# EAGLE design Jalosie4-DC24V current sensing -v01 (EAGLE 9.3.0)

## Sheet 1 of 2: Jalosieaktor DC24V 4-fach
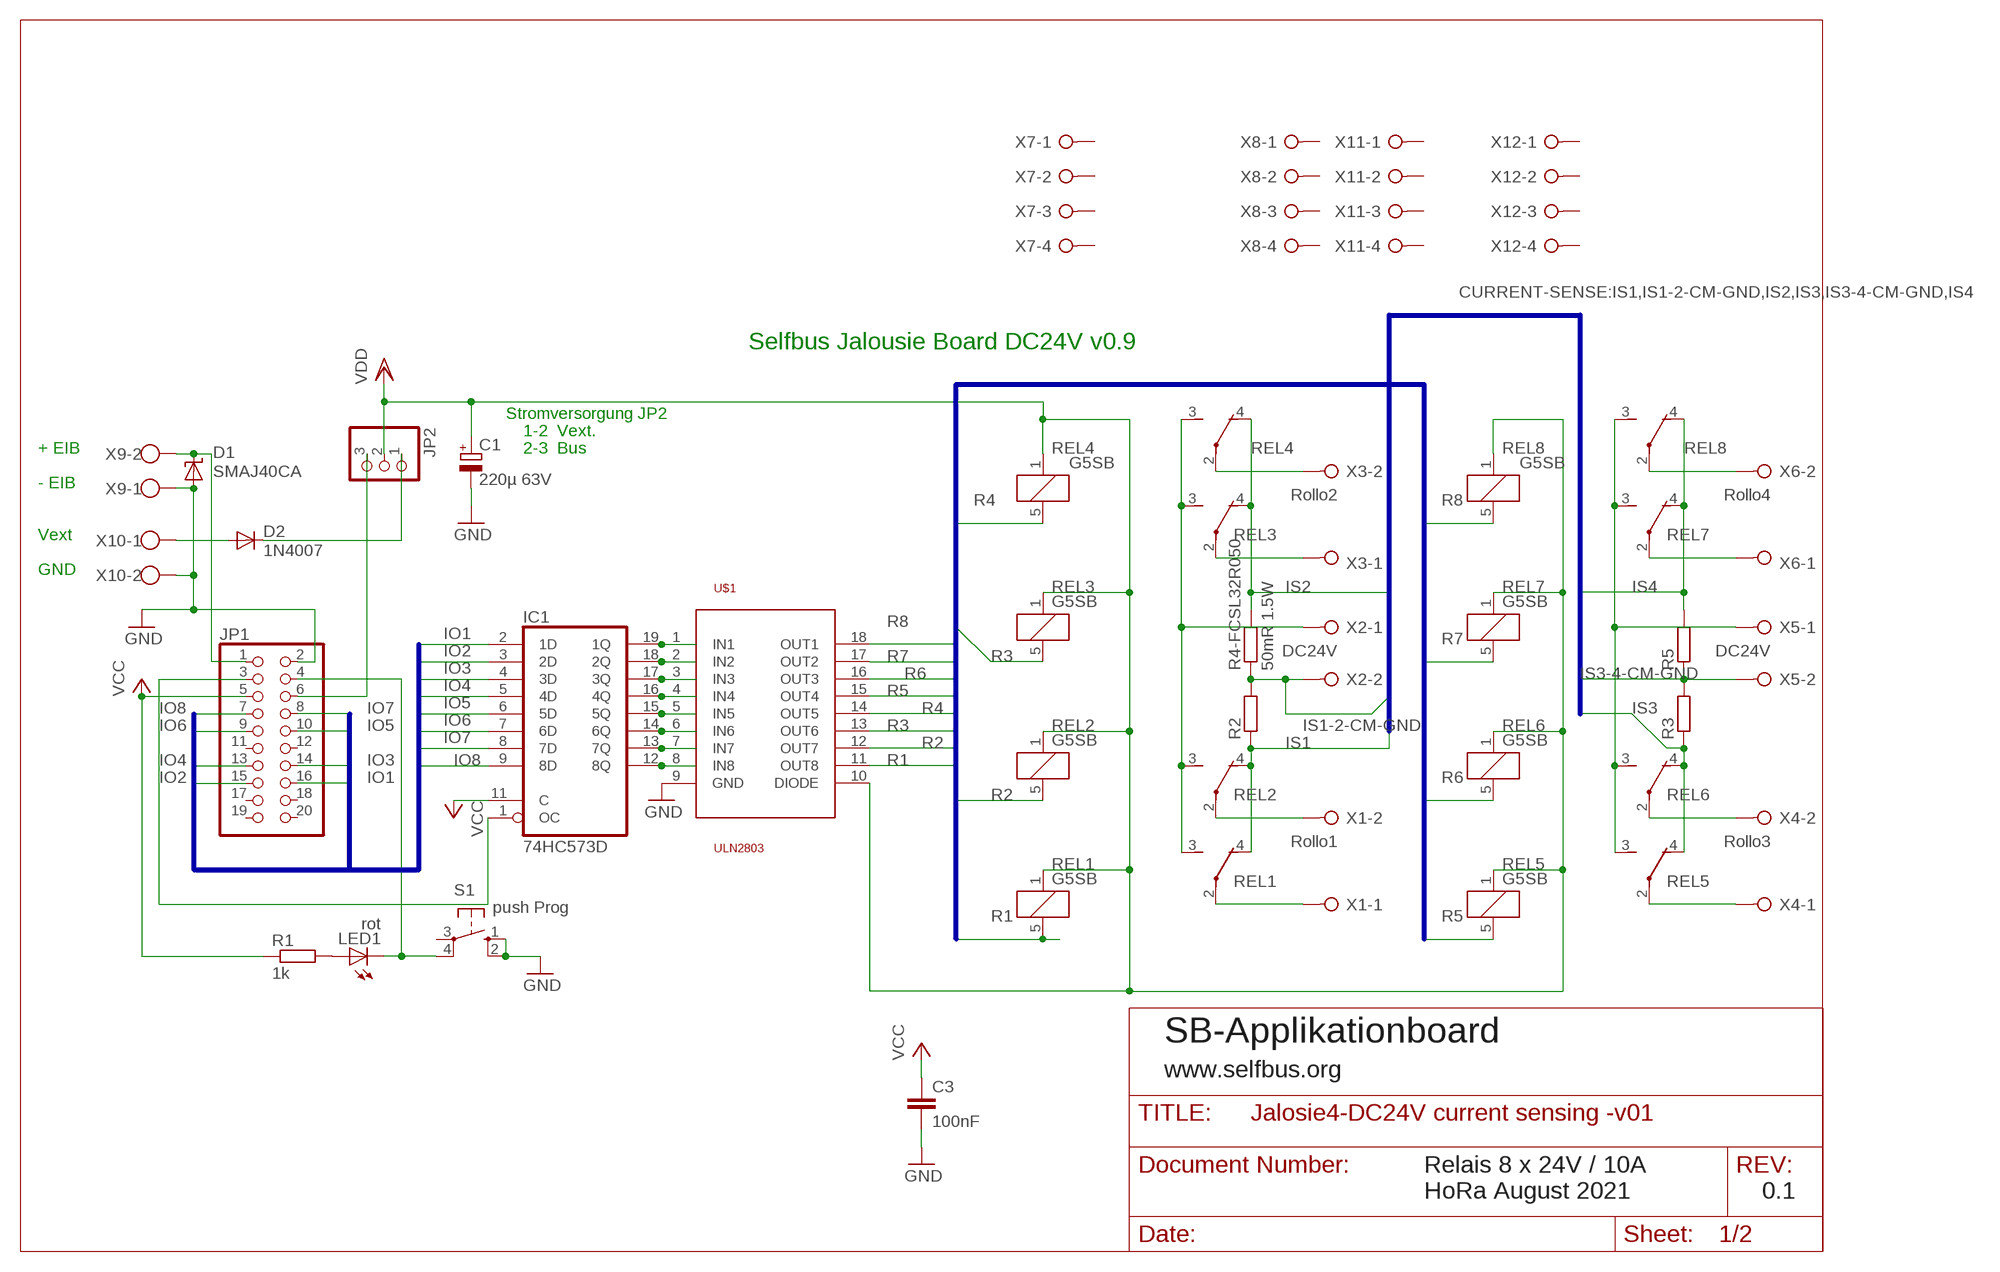
[diagram p0: schematic, sheet 1]

### Parts
C1  220µ 63V  CPOL-EUTT5D10  [TT5D10]
C3  100nF  C-EU050-024X044  [C050-024X044]
D1  SMAJ40CA  SUPPRESSOR-SMBJ  [SMBJ]
D2  1N4007  1N4004  [DO41-10]
IC1  74HC573D  [SO20W]
JP1  PINHD-2X10  [2X10]
JP2  PINHD-1X3  [1X03]
LED1  rot  LED3MM  [LED3MM]
R1  1k  R-EU_0204/7  [0204/7]
R2  R-EU_R3225  [R3225]
R3  R-EU_R3225  [R3225]
R4-FCSL32R050  50mR 1.5W  R-EU_R3225  [R3225]
R5  R-EU_R3225  [R3225]
REL1  G5SB  [G5SB]
REL2  G5SB  [G5SB]
REL3  G5SB  [G5SB]
REL4  G5SB  [G5SB]
REL5  G5SB  [G5SB]
REL6  G5SB  [G5SB]
REL7  G5SB  [G5SB]
REL8  G5SB  [G5SB]
S1  push Prog  10-XX  [B3F-10XX]
U$1  ULN2803  [SO18L]
X1  Rollo1  W237-02P  [W237-132]
X2  DC24V  W237-02P  [W237-132]
X3  Rollo2  W237-02P  [W237-132]
X4  Rollo3  W237-02P  [W237-132]
X5  DC24V  W237-02P  [W237-132]
X6  Rollo4  W237-02P  [W237-132]
X7  W237-04P  [W237-4P]
X8  W237-04P  [W237-4P]
X9  W237-102  [W237-102]
X10  W237-102  [W237-102]
X11  W237-04P  [W237-4P]
X12  W237-04P  [W237-4P]

### Nets
GND: C1.- C3.2 D1.A JP1.2 S1.1(S) S1.2(S1) U$1.9(GND) X9.1 X10.2 ; also sheet 2
IO1: IC1.2(1D) JP1.16
IO2: IC1.3(2D) JP1.15
IO3: IC1.4(3D) JP1.14
IO4: IC1.5(4D) JP1.13
IO5: IC1.6(5D) JP1.10
IO6: IC1.7(6D) JP1.9
IO7: IC1.8(7D) JP1.8
IO8: IC1.9(8D) JP1.7
IS1 [dc24v]: R2.1 REL1.4(U:O) REL2.4(U:O)
IS1-2-CM-GND [dc24v]: R2.2 R4-FCSL32R050.1 X2.2
IS2 [dc24v]: R4-FCSL32R050.2 REL3.4(U:O) REL4.4(U:O)
IS3 [dc24v]: R3.1 REL5.4(U:O) REL6.4(U:O)
IS3-4-CM-GND [dc24v]: R3.2 R5.1 X5.2
IS4 [dc24v]: R5.2 REL7.4(U:O) REL8.4(U:O)
N$2 [dc24v]: REL4.2(U:P) X3.2
N$3 [dc24v]: REL2.2(U:P) X1.2
N$4 [dc24v]: REL1.2(U:P) X1.1
N$5: REL3.2(U:P) X3.1
N$8 [dc24v]: REL5.3(U:S) REL6.3(U:S) REL7.3(U:S) REL8.3(U:S) X5.1
N$9 [dc24v]: REL7.2(U:P) X6.1
N$10 [dc24v]: REL8.2(U:P) X6.2
N$11: JP1.4 LED1.K(C) S1.4(P1)
N$12: LED1.A R1.2
N$13 [dc24v]: REL1.3(U:S) REL2.3(U:S) REL3.3(U:S) REL4.3(U:S) X2.1
N$14 [dc24v]: REL6.2(U:P) X4.2
N$15 [dc24v]: REL5.2(U:P) X4.1
N$17: D2.A X10.1
N$18: JP1.6 JP2.3
N$20: D1.C JP1.1 X9.2
N$21: IC1.19(1Q) U$1.1(IN1)
N$22: IC1.18(2Q) U$1.2(IN2)
N$23: IC1.17(3Q) U$1.3(IN3)
N$24: IC1.16(4Q) U$1.4(IN4)
N$25: IC1.15(5Q) U$1.5(IN5)
N$27: IC1.14(6Q) U$1.6(IN6)
N$28: IC1.13(7Q) U$1.7(IN7)
N$29: IC1.12(8Q) U$1.8(IN8)
N$31: D2.C JP2.1
N$33: IC1.1(OC) JP1.3
R1: REL1.5 U$1.11(OUT8)
R2: REL2.5 U$1.12(OUT7)
R3: REL3.5 U$1.13(OUT6)
R4: REL4.5 U$1.14(OUT5)
R5: REL5.5 U$1.15(OUT4)
R6: REL6.5 U$1.16(OUT3)
R7: REL7.5 U$1.17(OUT2)
R8: REL8.5 U$1.18(OUT1)
VCC: C3.1 IC1.11(C) JP1.5 R1.1 ; also sheet 2
VDD: C1.+ JP2.2 REL1.1 REL2.1 REL3.1 REL4.1 REL5.1 REL6.1 REL7.1 REL8.1 U$1.10(DIODE)
Unconnected: JP1.11 JP1.12 JP1.17 JP1.18 JP1.19 JP1.20 S1.3(P) X7.1 X7.2 X7.3 X7.4 X8.1 X8.2 X8.3 X8.4 X11.1 X11.2 X11.3 X11.4 X12.1 X12.2 X12.3 X12.4

### Buses
R[1..8]
IO[1..8]
CURRENT-SENSE:IS1,IS1-2-CM-GND,IS2,IS3,IS3-4-CM-GND,IS4

### Notes on the sheet
- Selfbus Jalousie Board DC24V v0.9
- Stromversorgung JP2
- 1-2  Vext.
- + EIB | 2-3  Bus
- - EIB
- Vext
- GND
- SB-Applikationboard
- www.selfbus.org
- Relais 8 x 24V / 10A
  HoRa August 2021
- 0.1

## Sheet 2 of 2
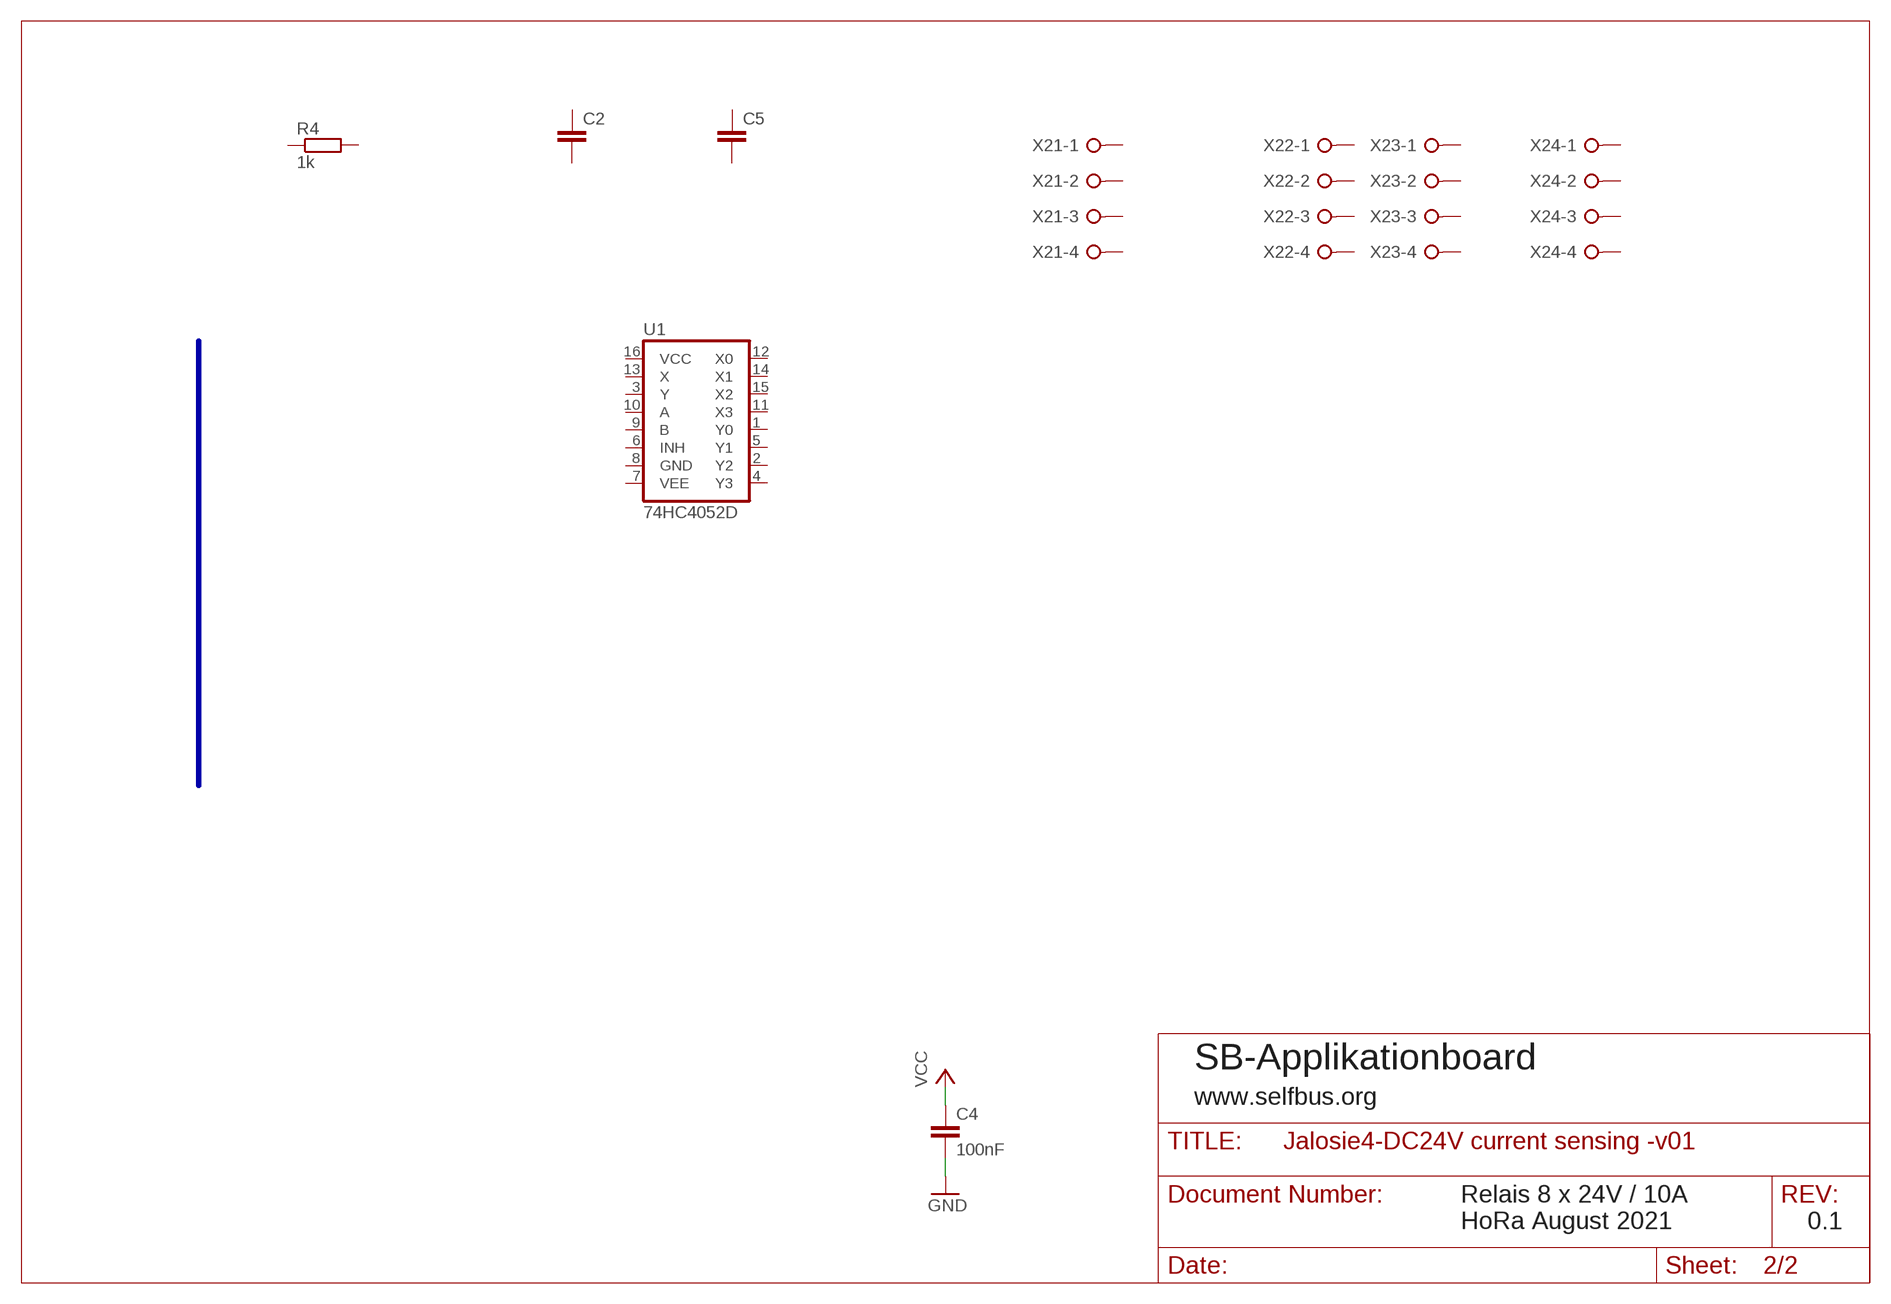
[diagram p1: schematic, sheet 2]

### Parts
C2  C-EUC0603  [C0603]
C4  100nF  C-EU050-024X044  [C050-024X044]
C5  C-EUC0603  [C0603]
R4  1k  R-EU_0204/7  [0204/7]
U1  74HC4052D  [SO16]
X21  W237-04P  [W237-4P]
X22  W237-04P  [W237-4P]
X23  W237-04P  [W237-4P]
X24  W237-04P  [W237-4P]

### Nets
GND: C4.2 ; also sheet 1
VCC: C4.1 ; also sheet 1
Unconnected: C2.1 C2.2 C5.1 C5.2 R4.1 R4.2 U1.1(Y0) U1.2(Y2) U1.3(Y) U1.4(Y3) U1.5(Y1) U1.6(INH) U1.9(B) U1.10(A) U1.11(X3) U1.12(X0) U1.13(X) U1.14(X1) U1.15(X2) X21.1 X21.2 X21.3 X21.4 X22.1 X22.2 X22.3 X22.4 X23.1 X23.2 X23.3 X23.4 X24.1 X24.2 X24.3 X24.4

### Buses
CURRENT-SENSE:IS1,IS1-2-CM-GND,IS2,IS3,IS3-4-CM-GND,IS4

### Notes on the sheet
- SB-Applikationboard
- www.selfbus.org
- Relais 8 x 24V / 10A
  HoRa August 2021
- 0.1

## Power pins joined to a net without a drawn wire
GND: IC1.10(GND) U1.8(GND)
VCC: IC1.20(VCC) U1.16(VCC)
VEE: U1.7(VEE)

## Library data of the parts
C1 = rcl:CPOL-EU: POLARIZED CAPACITOR, European symbol
C2 C5 = rcl:C-EU: CAPACITOR, European symbol; SPICEPREFIX: C
C3 C4 = rcl:C-EU: CAPACITOR, European symbol
D1 = diode:SUPPRESSOR-: Suppressor diode
D2 = diode:1N4004: DIODE general purpose rectifier, 1 A
IC1 = 74xx-eu:74*573: 8-bit D latch BUS DRIVER
JP1 = pinhead:PINHD-2X10: PIN HEADER
JP2 = pinhead:PINHD-1X3: PIN HEADER
LED1 = led:LED: LED OSRAM: - CHIPLED LG R971, LG N971, LY N971, LG Q971, LY Q971, LO R971, LY R971 LH N974, LH R974 LS Q976, LO Q976, LY Q976 LO Q996 - Hyper CHIPLED LW Q18S LB Q993, LB Q99A, LB R99A - SideLED LS A670, LO A670, LY A670, LG A670, LP A670 LB A673, LV A673, LT A673, LW A673 LH A674 LY A675 LS A676, LA A676, LO A676, LY A676, LW A676 LS A679, LY A679, LG A679 - Hyper Micro SIDELED® LS Y876, LA Y876, LO Y876, LY Y876 LT Y87S - SmartLED LW L88C, LW L88S LB L89C, LB L89S, LG L890 LS L89K, LO L89K, LY L89K LS L896, LA L896, LO L896, LY L896 - TOPLED LS T670, LO T670, LY T670, LG T670, LP T670 LSG T670, LSP T670, LSY T670, LOP T670, LYG T670 LG T671, LOG T671, LSG T671 LB T673, LV T673, LT T673, LW T673 LH T674 LS T676, LA T676, LO T676, LY T676, LB T676, LH T676, LSB T676, LW T676 LB T67C, LV T67C, LT T67C, LS T67K, LO T67K, LY T67K, LW E67C LS E67B, LA E67B, LO E67B, LY E67B, LB E67C, LV E67C, LT E67C LW T67C LS T679, LY T679, LG T679 LS T770, LO T770, LY T770, LG T770, LP T770 LB T773, LV T773, LT T773, LW T773 LH T774 LS E675, LA E675, LY E675, LS T675 LS T776, LA T776, LO T776, LY T776, LB T776 LHGB T686 LT T68C, LB T68C - Hyper Mini TOPLED® LB M676 - Mini TOPLED Santana® LG M470 LS M47K, LO M47K, LY M47K Source: http://www.osram.convergy.de - LUMILED® LXK2-PW12-R00, LXK2-PW12-S00, LXK2-PW14-U00, LXK2-PW14-V00 LXK2-PM12-R00, LXK2-PM12-S00, LXK2-PM14-U00 LXK2-PE12-Q00, LXK2-PE12-R00, LXK2-PE12-S00, LXK2-PE14-T00, LXK2-PE14-U00 LXK2-PB12-K00, LXK2-PB12-L00, LXK2-PB12-M00, LXK2-PB14-N00, LXK2-PB14-P00, LXK2-PB14-Q00 LXK2-PR12-L00, LXK2-PR12-M00, LXK2-PR14-Q00, LXK2-PR14-R00 LXK2-PD12-Q00, LXK2-PD12-R00, LXK2-PD12-S00 LXK2-PH12-R00, LXK2-PH12-S00 LXK2-PL12-P00, LXK2-PL12-Q00, LXK2-PL12-R00 Source: www.luxeon.com
R1 R4 = rcl:R-EU_: RESISTOR, European symbol
R2 R3 R4-FCSL32R050 R5 = rcl:R-EU_: RESISTOR, European symbol; SPICEPREFIX: R
REL1-REL8 = relay:G5SB: Compact Single-pole Relay for Switching 5 A Source: http://www.omron.com/ecb/products/pry/121/g5sb.html; OC_FARNELL: unknown; OC_NEWARK: unknown
S1 = switch-omron:10-XX: OMRON SWITCH
U1 = SparkFun-IC-Logic:74*4052: Dual 4:1 Analog Mux Dual four-channel analog MULTIPLEXER / DEMULTIPLEXER SparkFun Products SparkFun Vernier Interface Shield <https://www.sparkfun.com/products/12858> (DEV-12858); PROD_ID: IC-13103
U$1 = uln2803:ULN2803
X1-X6 = con-wago-508:W237-02P: WAGO SREW CLAMP; OC_FARNELL: unknown; OC_NEWARK: unknown
X7 X8 X11 X12 X21-X24 = con-wago-508:W237-04P: WAGO SREW CLAMP; OC_FARNELL: unknown; OC_NEWARK: unknown
X9 X10 = con-wago-500:W237-102: WAGO SCREW CLAMP

## Net classes
0 SELV: width 0.406 mm
1 dc24v: width 1.93 mm, clearance 1.27 mm to class 0, clearance 1.27 mm

## Board
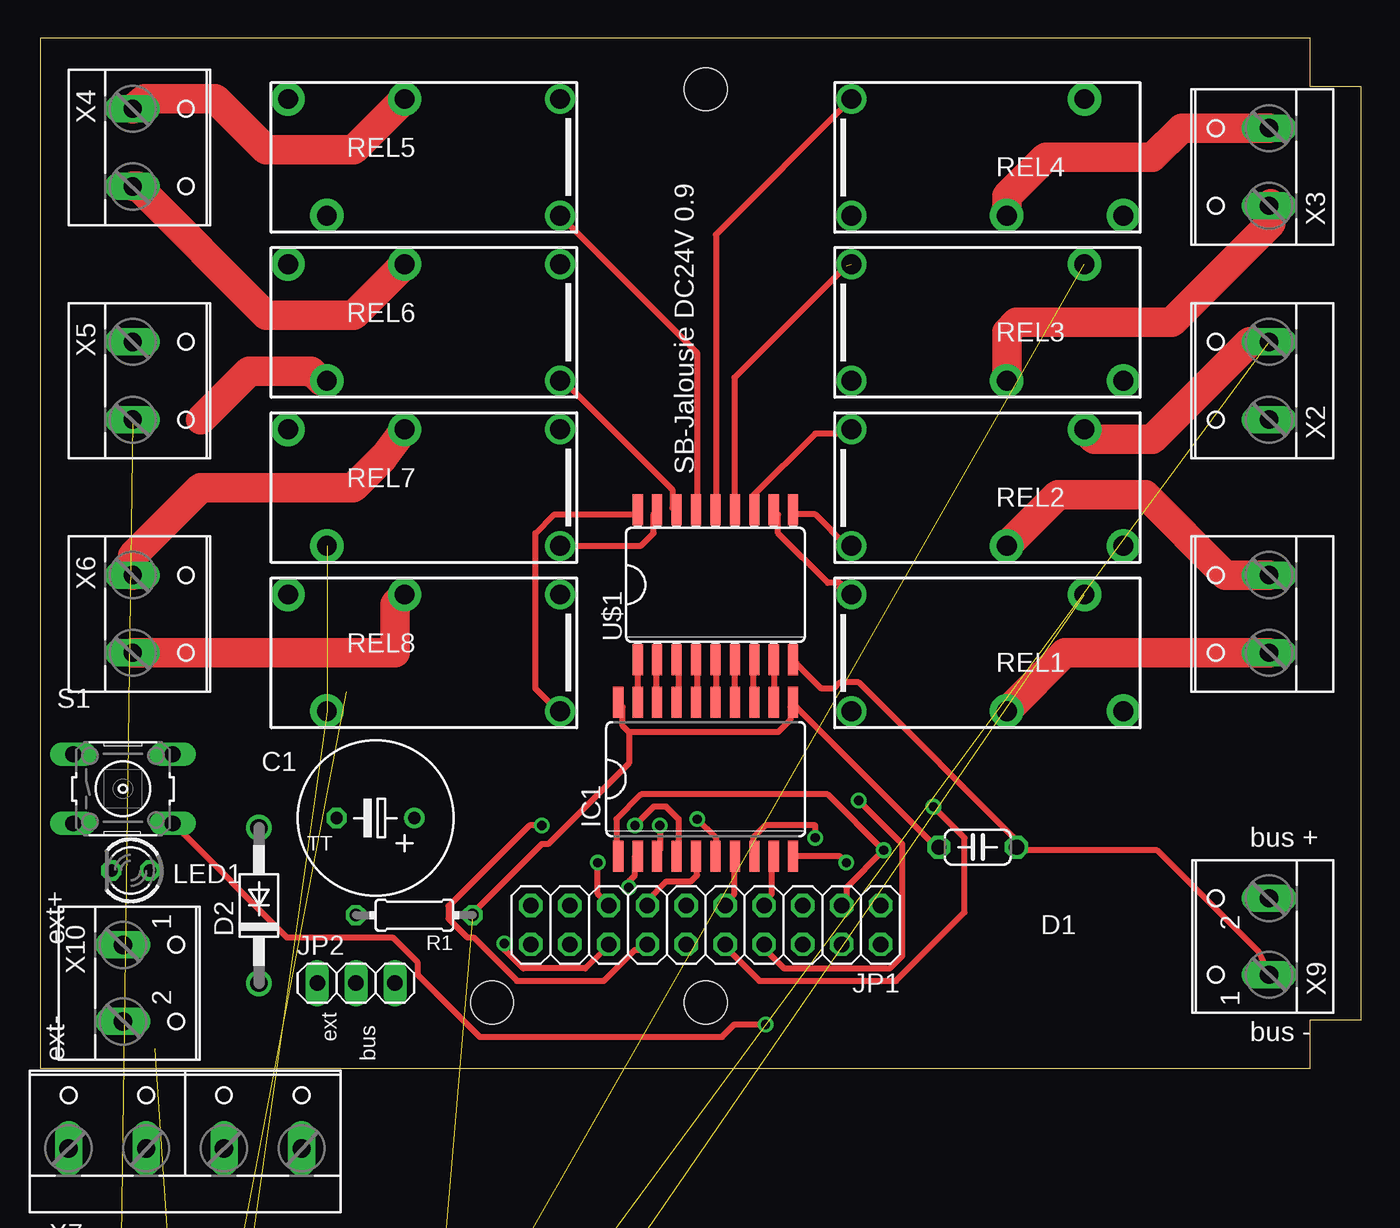
[diagram p2: board, top side]
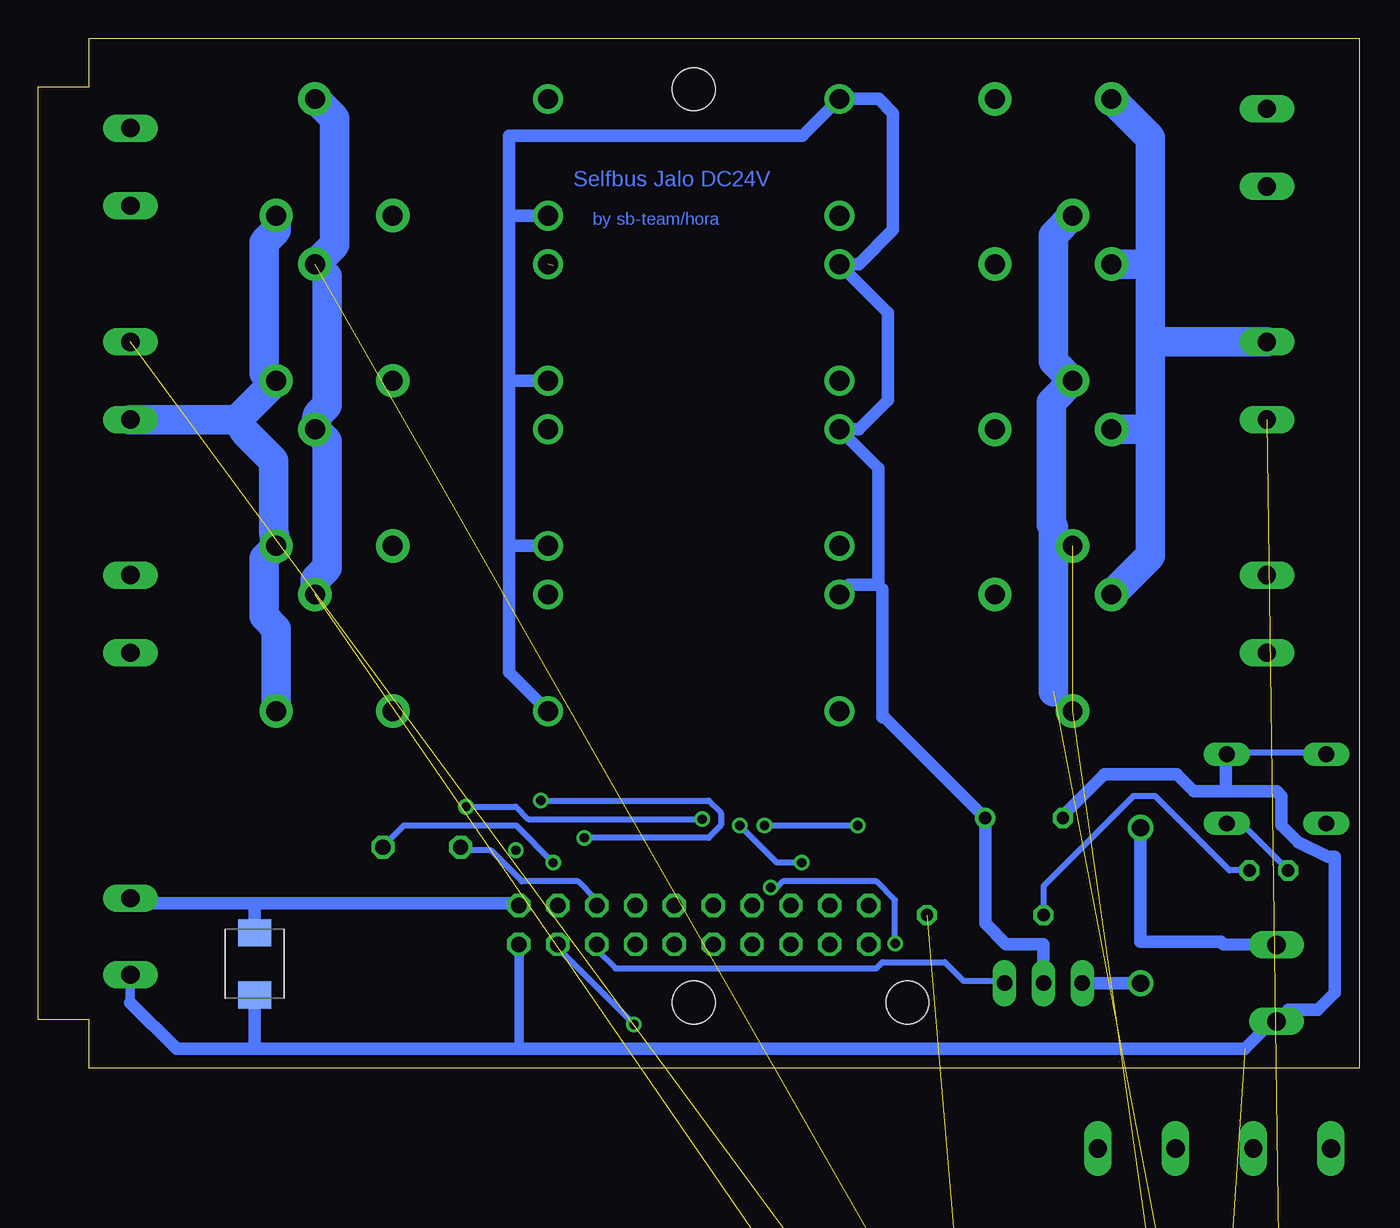
[diagram p3: board, bottom side, seen from below]

Size 86.35 x 67.31 mm. Coordinates in mm from the lower left corner, seen from the top.
Outline: 0,0.01 83.02,0 83.02,3.18 86.35,3.18 86.35,64.13 83.02,64.13 83.02,67.31 0,67.31 0,0.01
Copper layers (1*16): Top 0.035mm / dielectric 1.5mm / Bottom 0.035mm
Design rules "default *": minimum track width 10mil, minimum drill 24mil, track to track 16mil, track to pad 16mil, pad to pad 16mil, via to via 16mil, smd to smd 8mil, copper to edge 20mil, drill to drill 10mil, minimum pad ring 10mil, minimum via ring 8mil, stop-mask expansion 4mil, vias tented up to drill 0mil, thermal gap 10mil
Holes 2.8 mm at 43.49,4.29 43.49,63.98 29.52,4.29

### Footprints (pad centres in the part's own frame; a part is rotated, then mirrored left to right if it is on the bottom)
TT5D10 = drill 0.813: + -2.54,0 | drill 0.813 octagon: - 2.54,0
C0603 = smd 1.1 x 1: 1 -0.85,0; 2 0.85,0
C050-024X044 = drill 1 octagon: 1 -2.54,0; 2 2.54,0
SMBJ = smd 1.78 x 2.16: A 2.04,0; C -2.03,0
DO41-10 = drill 1.118: A 5.08,0; C -5.08,0
SO20W = smd 0.66 x 2.032: 1 -5.715,-5.029; 2 -4.445,-5.029; 3 -3.175,-5.029; 4 -1.905,-5.029; 5 -0.635,-5.029; 6 0.635,-5.029; 7 1.905,-5.029; 8 3.175,-5.029; 9 4.445,-5.029; 10 5.715,-5.029; 11 5.715,5.029; 12 4.445,5.029; 13 3.175,5.029; 14 1.905,5.029; 15 0.635,5.029; 16 -0.635,5.029; 17 -1.905,5.029; 18 -3.175,5.029; 19 -4.445,5.029; 20 -5.715,5.029
2X10 = drill 1.016 octagon: 1 -11.43,-1.27; 2 -11.43,1.27; 3 -8.89,-1.27; 4 -8.89,1.27; 5 -6.35,-1.27; 6 -6.35,1.27; 7 -3.81,-1.27; 8 -3.81,1.27; 9 -1.27,-1.27; 10 -1.27,1.27; 11 1.27,-1.27; 12 1.27,1.27; 13 3.81,-1.27; 14 3.81,1.27; 15 6.35,-1.27; 16 6.35,1.27; 17 8.89,-1.27; 18 8.89,1.27; 19 11.43,-1.27; 20 11.43,1.27
1X03 = drill 1.016 long: 1 -2.54,0; 2 0,0; 3 2.54,0
LED3MM = drill 0.813 octagon: A -1.27,0; K 1.27,0
0204/7 = drill 0.813 octagon: 1 -3.81,0; 2 3.81,0
R3225 = smd 1.6 x 2.7: 1 -1.4,0; 2 1.4,0
G5SB = drill 1.3 pad 1.93: 1 7.62,3.81; 5 7.62,-3.81 | drill 1.3 pad 2.184: 2 -2.54,3.81; 3 -10.16,3.81; 4 -7.62,-3.81
B3F-10XX = drill 1.016 long: 1 -3.251,2.261; 2 3.251,2.261; 3 -3.251,-2.261; 4 3.251,-2.261
SO16 = smd 0.6 x 1.2: 1 -4.445,-2.8; 2 -3.175,-2.8; 3 -1.905,-2.8; 4 -0.635,-2.8; 5 0.635,-2.8; 6 1.905,-2.8; 7 3.175,-2.8; 8 4.445,-2.8; 9 4.445,2.8; 10 3.175,2.8; 11 1.905,2.8; 12 0.635,2.8; 13 -0.635,2.8; 14 -1.905,2.8; 15 -3.175,2.8; 16 -4.445,2.8
SO18L = smd 0.66 x 2.032: 1 -5.08,-4.902; 2 -3.81,-4.902; 3 -2.54,-4.902; 4 -1.27,-4.902; 5 0,-4.902; 6 1.27,-4.902; 7 2.54,-4.902; 8 3.81,-4.902; 9 5.08,-4.902; 10 5.08,4.902; 11 3.81,4.902; 12 2.54,4.902; 13 1.27,4.902; 14 0,4.902; 15 -1.27,4.902; 16 -2.54,4.902; 17 -3.81,4.902; 18 -5.08,4.902
W237-132 = drill 1.194 long: 1 -2.54,-0.635; 2 2.54,-0.635
W237-4P = drill 1.194 long: 1 -7.62,-0.635; 2 -2.54,-0.635; 3 2.54,-0.635; 4 7.62,-0.635
W237-102 = drill 1.194 long: 1 -2.5,-1.27; 2 2.5,-1.27

### Placement (x,y rotation side)
C1  21.9,16.35 180 top
C2  1.04,-173.79 0 top  (outside the outline)
C3  61.27,14.45 0 top
C4  16.04,-163.79 0 top  (outside the outline)
C5  1.04,-177.79 0 top  (outside the outline)
D1  72.19,6.83 270 bottom
D2  14.28,10.64 90 top
IC1  43.49,18.89 0 top
JP1  43.49,9.37 180 top
JP2  20.63,5.56 0 top
LED1  5.9,12.92 180 top
R1  24.44,10 180 top
R2  3.04,-65.79 0 top  (outside the outline)
R3  3.04,-71.79 0 top  (outside the outline)
R4  4.04,-169.79 0 top  (outside the outline)
R4-FCSL32R050  2.34,-60.23 0 top  (outside the outline)
R5  3.04,-77.79 0 top  (outside the outline)
REL1  60.64,27.15 180 top
REL2  60.64,37.94 180 top
REL3  60.64,48.74 180 top
REL4  60.64,59.53 180 top
REL5  26.35,59.53 0 top
REL6  26.35,48.74 0 top
REL7  26.35,37.94 0 top
REL8  26.35,27.15 0 top
S1  5.39,18.26 0 top
U1  6.04,-182.79 0 top  (outside the outline)
U$1  44.13,31.59 0 top
X1  79.69,29.69 90 top
X2  79.69,44.93 90 top
X3  79.69,58.9 90 top
X4  6.66,60.17 270 top
X5  6.66,44.93 270 top
X6  6.66,29.69 270 top
X7  9.46,-4.6 0 top  (outside the outline)
X8  9.46,-16.54 0 top  (outside the outline)
X9  79.05,8.6 90 top
X10  6.66,5.56 270 top
X11  9.46,-28.48 0 top  (outside the outline)
X12  9.46,-40.42 0 top  (outside the outline)
X21  43.04,-97.79 0 top  (outside the outline)
X22  10.04,-110.79 0 top  (outside the outline)
X23  31.04,-110.79 0 top  (outside the outline)
X24  52.04,-110.79 0 top  (outside the outline)

### Tracks (layer width: path | path; a pad name or v marks a point on that pad's centre or on a via)
GND  (via drill 0.61)  (2 unrouted)
  Top 0.406: IC1.10 49.44,13.84 52.28,13.84 v52.69,13.43 | U$1.9 49.44,26.44 51.06,24.81 51.87,24.81 52.28,25.22 53.5,25.22 64.07,14.65 C3.2 64.07,14.24 73.01,14.24 79.64,7.61 X9.1
  Bottom 0.406: S1.2 8.52,20.64 2.34,20.64 2.22,20.48 S1.1 | v52.69,13.43 55.12,15.87 62.44,15.87 63.66,14.65
  Bottom 0.61: 80.32,4.29 80.32,6.06 X9.1 | 54.92,1.27 JP1.2
  Bottom 0.813: 72.19,1.27 54.92,1.27 7.46,1.27 5.67,3.06 X10.2 4.64,3.81 2.69,3.81 1.58,4.92 1.58,13.81 2.06,13.81 3.96,14.76 5.07,15.88 5.07,17.78 5.39,18.1 8.73,18.1 | 72.19,1.27 77.31,1.27 80.32,4.29 | 72.19,1.27 D1.A | 8.73,18.1 10.79,18.1 10.79,18.12 11.92,19.21 16.66,19.21 19.36,16.51 C1.- | S1.2 8.73,20.43 8.73,18.1 | C3.2 63.81,14.5 63.66,14.65
IO1  (via drill 0.61)
  Top 0.406: IC1.2 38.87,13.84 38.87,12.62 38.46,12.21 v38.46,11.8 | v30.33,8.15 30.33,7.74 31.55,6.52 35.62,6.52 36.84,7.74 JP1.16
  Bottom 0.406: v38.46,11.8 38.06,11.8 37.65,12.21 31.55,12.21 30.33,10.99 v30.33,8.15
IO2  (via drill 0.61)
  Top 0.406: v40.49,15.87 40.49,14.24 IC1.3 | v36.43,13.43 36.43,11.4 36.84,10.99 JP1.15
  Bottom 0.406: v40.49,15.87 38.06,13.43 v36.43,13.43
IO3  (via drill 0.61)
  Top 0.406: IC1.4 41.71,14.24 41.71,16.28 40.9,17.09 40.09,17.09 v38.87,15.87 | v32.77,15.87 31.96,15.87 26.68,10.59 26.68,9.77 27.9,8.55 28.3,8.55 31.15,5.71 36.84,5.71 38.87,7.74 39.68,7.74 JP1.14
  Bottom 0.406: v38.87,15.87 v32.77,15.87
IO4
  Top 0.406: IC1.5 42.93,13.84 42.93,12.62 42.53,12.21 40.9,12.21 39.68,10.99 JP1.13
IO5  (via drill 0.61)
  Top 0.406: v42.93,16.28 44.15,15.06 44.15,14.24 IC1.6 | v58.38,17.09 60.41,15.06 60.41,10.18 55.94,5.71 47,5.71 44.96,7.74 JP1.10
  Bottom 0.406: v42.93,16.28 54.31,16.28 55.12,17.09 v58.38,17.09
IO6
  Top 0.406: IC1.7 45.37,13.84 45.37,11.4 44.96,10.99 JP1.9
IO7  (via drill 0.61)
  Top 0.406: IC1.8 46.59,14.24 46.59,15.06 47.4,15.87 50.65,15.87 v50.65,15.06 | JP1.8 47.4,7.74 48.62,6.52 55.53,6.52 56.34,7.33 56.34,14.65 v53.5,17.49
  Bottom 0.406: v50.65,15.06 42.53,15.06 41.71,15.87 41.71,16.68 42.53,17.49 v53.5,17.49
IO8
  Top 0.406: IC1.9 47.81,13.84 47.81,11.4 47.4,10.99 JP1.7
IS1  (1 unrouted)
  Top 1.93: REL2.4 68.89,41.12 72.7,41.12 79.05,47.47
  Bottom 1.93: REL1.4 68.26,31.91 67.46,32.7 67.46,40.96 REL2.4 68.1,42.7 67.46,43.34 67.46,51.75
IS1-2-CM-GND  (2 unrouted)
IS2  (1 unrouted)
  Bottom 1.93: REL3.4 66.99,53.82 66.99,62.07 REL4.4
IS3  (1 unrouted)
  Top 1.93: 10.47,42.39 13.65,45.56 17.71,45.56 18.35,44.93 REL6.4
  Bottom 1.93: REL5.4 20,54.45 20,46.2 REL6.4 20.12,43.53 20.12,35.53 20,35.4 20,34.13 20,24.61
IS3-4-CM-GND  (2 unrouted)
IS4  (2 unrouted)
N$2
  Top 1.93: X3.2 74.61,61.44 72.7,59.53 65.72,59.53 63.18,56.99 REL4.2
N$3
  Top 1.93: X1.2 77.46,32.23 72.23,37.47 66.51,37.47 REL2.2
N$4
  Top 1.93: X1.1 66.99,27.15 REL1.2
N$5
  Top 0.813: X3.1 80.45,56.48
  Top 1.93: REL3.2 63.18,48.1 63.81,48.74 73.97,48.74 80.45,55.21 80.45,56.48
N$8
  Bottom 1.93: 13.65,52.55 13.65,60.8 REL5.3 | 13.65,52.55 13.65,47.47 | 13.65,47.47 13.65,41.75 | 13.65,41.75 13.65,33.5 REL8.3 | 13.65,41.75 REL7.3 | 13.65,52.55 REL6.3 | X5.1 11.74,47.47 13.65,47.47
N$9
  Top 1.93: REL7.2 22.43,39.92 20.45,37.94 10.47,37.94 6.03,33.5 X6.1
N$10
  Top 1.93: REL8.2 23.17,30.32 23.17,27.15 X6.2
N$11  (via drill 0.61)
  Top 0.406: v47.4,2.86 45.37,2.86 44.56,2.05 28.71,2.05 24.64,6.12 24.64,6.93 23.02,8.55 16.11,8.55 8.8,15.87 S1.4
  Bottom 0.406: v47.4,2.86 52.28,7.74 JP1.4 | S1.4 7.7,16 LED1.K
N$12
  Bottom 0.406: R1.2 20.63,11.91 14.76,17.78 13.33,17.78 8.47,12.92 LED1.A
N$13
  Bottom 1.93: REL1.3 70.8,28.73 71.59,29.53 71.59,33.34 REL2.3 70.96,35.08 70.96,39.69 72.86,41.59 73.34,42.39 | 73.34,42.39 X2.1 | 73.34,42.39 REL3.3 71.59,45.4 71.59,53.98 70.8,54.77 REL4.3
N$14
  Top 1.93: X4.2 6.34,57.63 14.76,49.21 18.09,49.21 20.47,49.21 REL6.2
N$15
  Top 1.93: REL5.2 20.47,60.01 18.09,60.01 14.76,60.01 11.42,63.34 6.82,63.34 X4.1
N$17
  Bottom 0.813: X10.1 8.88,8.1 9.04,8.26 14.28,8.26 D2.A
N$18
  Bottom 0.406: JP2.3 23.43,5.71 25.86,5.71 27.08,6.93 31.15,6.93 31.55,6.52 48.62,6.52 49.84,7.74 JP1.6
N$20
  Bottom 0.61: 54.76,10.8 54.62,10.51 JP1.1
  Bottom 0.813: 54.76,10.8 72.19,10.8 | 72.19,10.8 D1.C | X9.2 80.01,10.8 72.19,10.8
N$21
  Top 0.406: U$1.1 39.02,26.66 39.02,23.95 IC1.19
N$22
  Top 0.406: U$1.2 40.24,26.61 40.24,24 IC1.18
N$23
  Top 0.406: IC1.17 41.71,24 41.71,26.44 U$1.3
N$24
  Top 0.406: IC1.16 42.93,24 42.93,26.44 U$1.4
N$25
  Top 0.406: IC1.15 44.15,24 44.15,26.44 U$1.5
N$27
  Top 0.406: IC1.14 45.37,24 45.37,26.44 U$1.6
N$28
  Top 0.406: IC1.13 46.59,24 46.59,26.44 U$1.7
N$29
  Top 0.406: IC1.12 47.96,23.93 47.96,26.67 U$1.8
N$31
  Bottom 0.813: JP2.1 D2.C
N$33  (via drill 0.61)
  Top 0.406: IC1.1 37.65,14.24 37.65,16.28 39.28,17.9 51.47,17.9 v55.12,14.24 52.69,11.8 52.69,10.99 JP1.3
R1
  Top 0.406: REL1.5 52.69,31.31 52.28,31.31 52.27,31.48 52.38,31.59 52.28,31.72 51.47,31.72 48.22,34.97 48.22,36.19 U$1.11
R2
  Top 0.406: U$1.12 46.59,36.6 46.59,37.41 50.65,41.47 52.69,41.47 REL2.5
R3  (1 unrouted)
  Top 0.406: 52.69,52.44 45.37,45.13 45.37,36.6 U$1.13
R4
  Top 0.406: REL4.5 44.15,54.48 44.15,36.6 U$1.14
R5
  Top 0.406: REL5.5 42.93,46.76 42.93,36.6 U$1.15
R6
  Top 0.406: U$1.16 41.31,36.6 41.31,37.81 33.99,45.13 REL6.5
R7
  Top 0.406: U$1.17 40.09,36.19 40.09,34.97 39.28,34.16 33.99,34.16 REL7.5
R8
  Top 0.406: U$1.18 38.87,36.19 33.59,36.19 32.37,34.97 32.37,24.81 33.59,23.59 REL8.5
VCC  (2 unrouted)
  Top 0.406: 38.46,21.96 38.06,22.37 38.06,23.59 IC1.20 | 38.46,21.96 48.22,21.96 49.03,22.78 49.03,23.59 IC1.11 49.44,23.59 58.38,14.65 C3.1 | 38.46,21.96 38.46,19.93 33.18,14.65 32.77,14.65 28.3,10.18 R1.1
  Bottom 0.406: C3.1 58.38,14.24 56.75,14.24 54.72,12.21 51.06,12.21 49.84,10.99 JP1.5
VDD
  Top 0.406: 52.69,34.16 50.65,36.19 49.44,36.19 U$1.10
  Top 0.813: REL2.1 52.71,34.13 52.69,34.16
  Bottom 0.406: 31.15,31.31 31.43,31.59
  Bottom 0.813: JP2.2 20.63,8.1 23.08,8.1 24.44,9.46 C1.+ | REL1.1 55.56,25.88 55.56,34.26 | 55.56,34.26 55.56,44.93 | 55.56,44.93 55.56,55.72 | REL8.1 33.33,31.59 31.43,31.59 31.43,39.21 REL7.1 32.7,41.75 30.79,43.66 30.79,49.37 REL6.1 32.7,52.55 30.46,54.79 30.46,62.4 31.4,63.34 REL5.1 36.38,60.93 55.56,60.93 55.56,55.72 | REL4.1 55.56,55.72 | REL3.1 55.56,44.93 | C1.+ | C1.+ 31.02,22.93 31.15,22.93 31.15,31.31 | REL2.1 55.43,34.13 55.56,34.26

### Text on the board
Bottom: Selfbus Jalo DC24V | by sb-team/hora
tPlace: SB-Jalousie DC24V 0.9 | bus + | ext+ | ext | bus - | ext- | bus